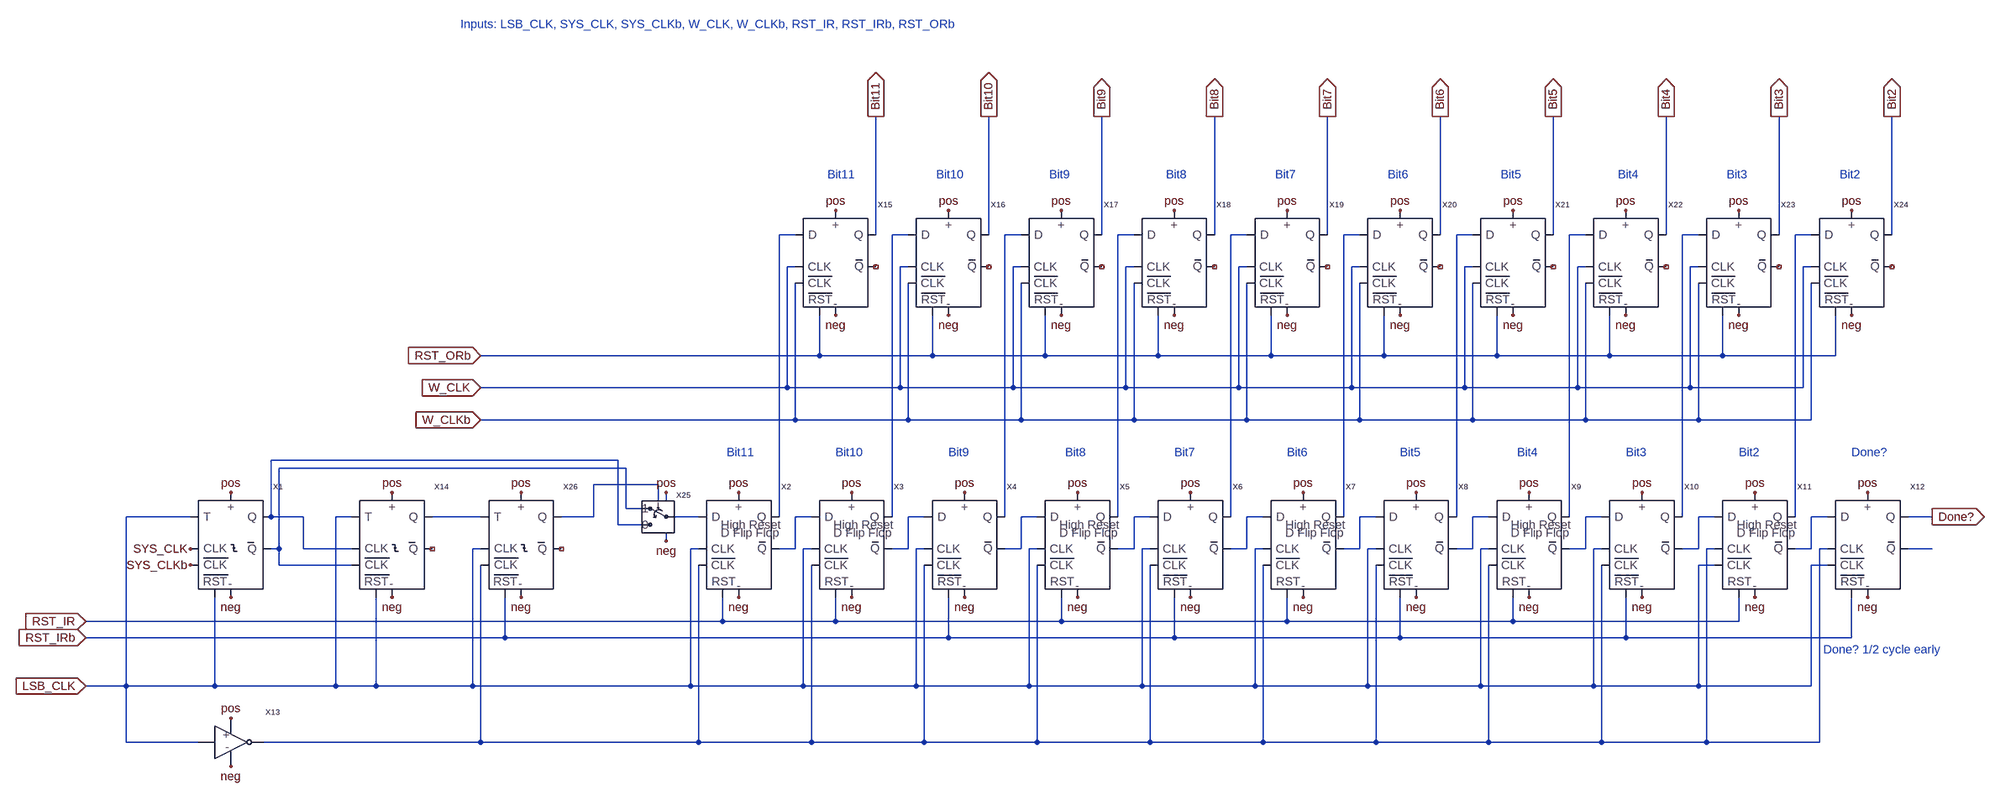
[diagram p0: schematic lsb_registers.asc]
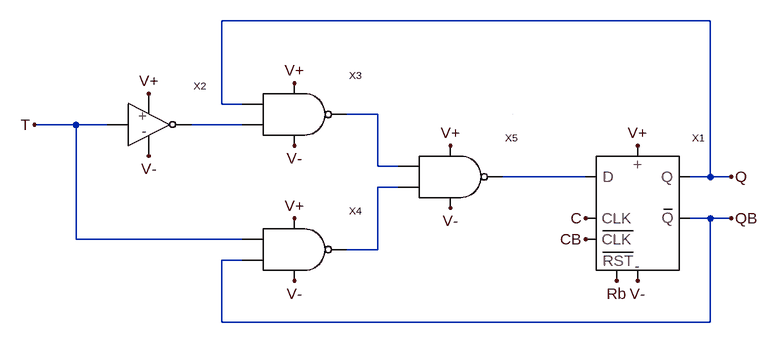
[diagram p1: sub-circuit t_flipflopreset_fe.asc]
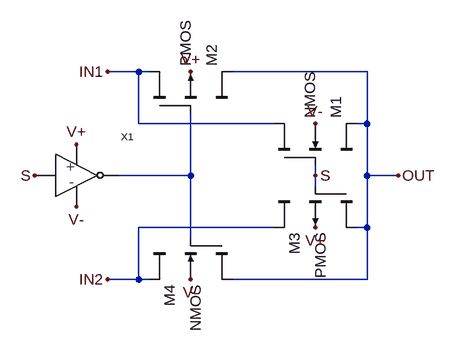
[diagram p2: sub-circuit spdt_1.asc]
lsb_registers.asc, the LTspice schematic file:
Version 4
SHEET 1 2676 1504
WIRE -1392 336 -1424 336
WIRE -1232 336 -1232 80
WIRE -1168 336 -1200 336
WIRE -1008 336 -1008 80
WIRE -944 336 -976 336
WIRE -784 336 -784 80
WIRE -720 336 -752 336
WIRE -560 336 -560 80
WIRE -496 336 -528 336
WIRE -336 336 -336 80
WIRE -272 336 -304 336
WIRE -112 336 -112 80
WIRE -48 336 -80 336
WIRE 112 336 112 80
WIRE 176 336 144 336
WIRE 336 336 336 80
WIRE 400 336 368 336
WIRE 560 336 560 80
WIRE 624 336 592 336
WIRE 784 336 784 80
WIRE -1392 400 -1408 400
WIRE -1168 400 -1184 400
WIRE -944 400 -960 400
WIRE -720 400 -736 400
WIRE -496 400 -512 400
WIRE -272 400 -288 400
WIRE -48 400 -64 400
WIRE 176 400 160 400
WIRE 400 400 384 400
WIRE 624 400 608 400
WIRE -1344 576 -1344 496
WIRE -1344 576 -2016 576
WIRE -1120 576 -1120 496
WIRE -1120 576 -1344 576
WIRE -896 576 -896 496
WIRE -896 576 -1120 576
WIRE -672 576 -672 496
WIRE -672 576 -896 576
WIRE -448 576 -448 496
WIRE -448 576 -672 576
WIRE -224 576 -224 496
WIRE -224 576 -448 576
WIRE 0 576 0 496
WIRE 0 576 -224 576
WIRE 224 576 224 496
WIRE 224 576 0 576
WIRE 448 576 448 496
WIRE 448 576 224 576
WIRE 672 576 672 496
WIRE 672 576 448 576
WIRE -1408 640 -1408 400
WIRE -1408 640 -2016 640
WIRE -1184 640 -1184 400
WIRE -1184 640 -1408 640
WIRE -960 640 -960 400
WIRE -960 640 -1184 640
WIRE -736 640 -736 400
WIRE -736 640 -960 640
WIRE -512 640 -512 400
WIRE -512 640 -736 640
WIRE -288 640 -288 400
WIRE -288 640 -512 640
WIRE -64 640 -64 400
WIRE -64 640 -288 640
WIRE 160 640 160 400
WIRE 160 640 -64 640
WIRE 384 640 384 400
WIRE 384 640 160 640
WIRE 608 640 608 400
WIRE 608 640 384 640
WIRE -1392 704 -1392 432
WIRE -1392 704 -2016 704
WIRE -1168 704 -1168 432
WIRE -1168 704 -1392 704
WIRE -944 704 -944 432
WIRE -944 704 -1168 704
WIRE -720 704 -720 432
WIRE -720 704 -944 704
WIRE -496 704 -496 432
WIRE -496 704 -720 704
WIRE -272 704 -272 432
WIRE -272 704 -496 704
WIRE -48 704 -48 432
WIRE -48 704 -272 704
WIRE 176 704 176 432
WIRE 176 704 -48 704
WIRE 400 704 400 432
WIRE 400 704 176 704
WIRE 624 704 624 432
WIRE 624 704 400 704
WIRE -1744 784 -2432 784
WIRE -1728 800 -2416 800
WIRE -1664 832 -1792 832
WIRE -1664 864 -1664 832
WIRE -1648 864 -1648 848
WIRE -1728 880 -1728 800
WIRE -1696 880 -1728 880
WIRE -2592 896 -2720 896
WIRE -2432 896 -2432 784
WIRE -2368 896 -2432 896
WIRE -2272 896 -2304 896
WIRE -2016 896 -2112 896
WIRE -1792 896 -1792 832
WIRE -1792 896 -1856 896
WIRE -1584 896 -1632 896
WIRE -1424 896 -1424 336
WIRE -1360 896 -1392 896
WIRE -1200 896 -1200 336
WIRE -1136 896 -1168 896
WIRE -976 896 -976 336
WIRE -912 896 -944 896
WIRE -752 896 -752 336
WIRE -688 896 -720 896
WIRE -528 896 -528 336
WIRE -464 896 -496 896
WIRE -304 896 -304 336
WIRE -240 896 -272 896
WIRE -80 896 -80 336
WIRE -16 896 -48 896
WIRE 144 896 144 336
WIRE 208 896 176 896
WIRE 368 896 368 336
WIRE 432 896 400 896
WIRE 592 896 592 336
WIRE 656 896 624 896
WIRE 864 896 816 896
WIRE -1744 912 -1744 784
WIRE -1696 912 -1744 912
WIRE -1648 944 -1648 928
WIRE -2416 960 -2416 800
WIRE -2416 960 -2432 960
WIRE -2368 960 -2368 896
WIRE -2272 960 -2368 960
WIRE -2016 960 -2032 960
WIRE -1584 960 -1600 960
WIRE -1392 960 -1392 896
WIRE -1392 960 -1424 960
WIRE -1360 960 -1376 960
WIRE -1168 960 -1168 896
WIRE -1168 960 -1200 960
WIRE -1136 960 -1152 960
WIRE -944 960 -944 896
WIRE -944 960 -976 960
WIRE -912 960 -928 960
WIRE -720 960 -720 896
WIRE -720 960 -752 960
WIRE -688 960 -704 960
WIRE -496 960 -496 896
WIRE -496 960 -528 960
WIRE -464 960 -480 960
WIRE -272 960 -272 896
WIRE -272 960 -304 960
WIRE -240 960 -256 960
WIRE -48 960 -48 896
WIRE -48 960 -80 960
WIRE -16 960 -32 960
WIRE 176 960 176 896
WIRE 176 960 144 960
WIRE 208 960 192 960
WIRE 400 960 400 896
WIRE 400 960 368 960
WIRE 432 960 416 960
WIRE 624 960 624 896
WIRE 624 960 592 960
WIRE 656 960 640 960
WIRE 864 960 816 960
WIRE -2416 992 -2416 960
WIRE -2272 992 -2416 992
WIRE 432 992 400 992
WIRE 656 992 624 992
WIRE -1536 1104 -1536 1056
WIRE -1536 1104 -2800 1104
WIRE -1312 1104 -1312 1056
WIRE -1312 1104 -1536 1104
WIRE -864 1104 -864 1056
WIRE -864 1104 -1312 1104
WIRE -416 1104 -416 1056
WIRE -416 1104 -864 1104
WIRE 32 1104 32 1056
WIRE 32 1104 -416 1104
WIRE 480 1104 480 1056
WIRE 480 1104 32 1104
WIRE -1968 1136 -1968 1056
WIRE -1968 1136 -2800 1136
WIRE -1088 1136 -1088 1056
WIRE -1088 1136 -1968 1136
WIRE -640 1136 -640 1056
WIRE -640 1136 -1088 1136
WIRE -192 1136 -192 1056
WIRE -192 1136 -640 1136
WIRE 256 1136 256 1056
WIRE 256 1136 -192 1136
WIRE 704 1136 704 1056
WIRE 704 1136 256 1136
WIRE -2720 1232 -2720 896
WIRE -2720 1232 -2800 1232
WIRE -2544 1232 -2544 1056
WIRE -2544 1232 -2720 1232
WIRE -2304 1232 -2304 896
WIRE -2304 1232 -2544 1232
WIRE -2224 1232 -2224 1056
WIRE -2224 1232 -2304 1232
WIRE -2032 1232 -2032 960
WIRE -2032 1232 -2224 1232
WIRE -1600 1232 -1600 960
WIRE -1600 1232 -2032 1232
WIRE -1376 1232 -1376 960
WIRE -1376 1232 -1600 1232
WIRE -1152 1232 -1152 960
WIRE -1152 1232 -1376 1232
WIRE -928 1232 -928 960
WIRE -928 1232 -1152 1232
WIRE -704 1232 -704 960
WIRE -704 1232 -928 1232
WIRE -480 1232 -480 960
WIRE -480 1232 -704 1232
WIRE -256 1232 -256 960
WIRE -256 1232 -480 1232
WIRE -32 1232 -32 960
WIRE -32 1232 -256 1232
WIRE 192 1232 192 960
WIRE 192 1232 -32 1232
WIRE 400 1232 400 992
WIRE 400 1232 192 1232
WIRE 624 1232 624 992
WIRE 624 1232 400 1232
WIRE -2720 1344 -2720 1232
WIRE -2576 1344 -2720 1344
WIRE -2016 1344 -2016 992
WIRE -2016 1344 -2448 1344
WIRE -1584 1344 -1584 992
WIRE -1584 1344 -2016 1344
WIRE -1360 1344 -1360 992
WIRE -1360 1344 -1584 1344
WIRE -1136 1344 -1136 992
WIRE -1136 1344 -1360 1344
WIRE -912 1344 -912 992
WIRE -912 1344 -1136 1344
WIRE -688 1344 -688 992
WIRE -688 1344 -912 1344
WIRE -464 1344 -464 992
WIRE -464 1344 -688 1344
WIRE -240 1344 -240 992
WIRE -240 1344 -464 1344
WIRE -16 1344 -16 992
WIRE -16 1344 -240 1344
WIRE 208 1344 208 992
WIRE 208 1344 -16 1344
WIRE 416 1344 416 960
WIRE 416 1344 208 1344
WIRE 640 1344 640 960
WIRE 640 1344 416 1344
FLAG -2800 1232 LSB_CLK
IOPIN -2800 1232 In
FLAG -2512 1296 pos
FLAG -2592 960 SYS_CLK
FLAG -2592 992 SYS_CLKb
FLAG -2800 1136 RST_IRb
IOPIN -2800 1136 In
FLAG -2016 704 W_CLKb
IOPIN -2016 704 In
FLAG -2016 640 W_CLK
IOPIN -2016 640 In
FLAG -2800 1104 RST_IR
IOPIN -2800 1104 In
FLAG -2016 576 RST_ORb
IOPIN -2016 576 In
FLAG -1232 80 Bit11
IOPIN -1232 80 Out
FLAG -1008 80 Bit10
IOPIN -1008 80 Out
FLAG -784 80 Bit9
IOPIN -784 80 Out
FLAG -560 80 Bit8
IOPIN -560 80 Out
FLAG -336 80 Bit7
IOPIN -336 80 Out
FLAG -112 80 Bit6
IOPIN -112 80 Out
FLAG 112 80 Bit5
IOPIN 112 80 Out
FLAG 336 80 Bit4
IOPIN 336 80 Out
FLAG 560 80 Bit3
IOPIN 560 80 Out
FLAG 784 80 Bit2
IOPIN 784 80 Out
FLAG -1312 288 pos
FLAG -1088 288 pos
FLAG -864 288 pos
FLAG -640 288 pos
FLAG -416 288 pos
FLAG -192 288 pos
FLAG 32 288 pos
FLAG 256 288 pos
FLAG 480 288 pos
FLAG 704 288 pos
FLAG -2512 848 pos
FLAG -1504 848 pos
FLAG -1280 848 pos
FLAG -1056 848 pos
FLAG -832 848 pos
FLAG -608 848 pos
FLAG -384 848 pos
FLAG -160 848 pos
FLAG 64 848 pos
FLAG 288 848 pos
FLAG 512 848 pos
FLAG 736 848 pos
FLAG -1312 496 neg
FLAG -1088 496 neg
FLAG -864 496 neg
FLAG -640 496 neg
FLAG -416 496 neg
FLAG -192 496 neg
FLAG 32 496 neg
FLAG 256 496 neg
FLAG 480 496 neg
FLAG 704 496 neg
FLAG 736 1056 neg
FLAG 512 1056 neg
FLAG 288 1056 neg
FLAG 64 1056 neg
FLAG -160 1056 neg
FLAG -384 1056 neg
FLAG -608 1056 neg
FLAG -832 1056 neg
FLAG -1056 1056 neg
FLAG -1280 1056 neg
FLAG -1504 1056 neg
FLAG -2512 1056 neg
FLAG 864 896 Done?
IOPIN 864 896 Out
FLAG -2512 1392 neg
FLAG -1648 944 neg
FLAG -1648 848 pos
FLAG -2192 848 pos
FLAG -2192 1056 neg
FLAG -1936 848 pos
FLAG -1936 1056 neg
SYMBOL T_FlipFlopReset_FE -2544 992 R0
SYMATTR InstName X1
SYMBOL FlipFlop -1056 960 R0
SYMATTR InstName X4
SYMATTR SpiceLine nmosL=0.9u nmosW=3u pmosL=0.9u pmosW=6u
SYMBOL FlipFlop -608 960 R0
SYMATTR InstName X6
SYMATTR SpiceLine nmosL=0.9u nmosW=3u pmosL=0.9u pmosW=6u
SYMBOL FlipFlop -160 960 R0
SYMATTR InstName X8
SYMATTR SpiceLine nmosL=0.9u nmosW=3u pmosL=0.9u pmosW=6u
SYMBOL FlipFlop 288 960 R0
SYMATTR InstName X10
SYMATTR SpiceLine nmosL=0.9u nmosW=3u pmosL=0.9u pmosW=6u
SYMBOL FlipFlop 736 960 R0
SYMATTR InstName X12
SYMATTR SpiceLine nmosL=0.9u nmosW=3u pmosL=0.9u pmosW=6u
SYMBOL Inverter -2512 1344 R0
SYMATTR InstName X13
SYMATTR SpiceLine nmosL=0.9u nmosW=12u pmosL=0.9u pmosW=24u
SYMBOL FlipFlop -1312 400 R0
SYMATTR InstName X15
SYMATTR SpiceLine nmosL=0.9u nmosW=3u pmosL=0.9u pmosW=6u
SYMBOL FlipFlop -1088 400 R0
SYMATTR InstName X16
SYMATTR SpiceLine nmosL=0.9u nmosW=3u pmosL=0.9u pmosW=6u
SYMBOL FlipFlop -864 400 R0
SYMATTR InstName X17
SYMATTR SpiceLine nmosL=0.9u nmosW=3u pmosL=0.9u pmosW=6u
SYMBOL FlipFlop -640 400 R0
SYMATTR InstName X18
SYMATTR SpiceLine nmosL=0.9u nmosW=3u pmosL=0.9u pmosW=6u
SYMBOL FlipFlop -416 400 R0
SYMATTR InstName X19
SYMATTR SpiceLine nmosL=0.9u nmosW=3u pmosL=0.9u pmosW=6u
SYMBOL FlipFlop -192 400 R0
SYMATTR InstName X20
SYMATTR SpiceLine nmosL=0.9u nmosW=3u pmosL=0.9u pmosW=6u
SYMBOL FlipFlop 32 400 R0
SYMATTR InstName X21
SYMATTR SpiceLine nmosL=0.9u nmosW=3u pmosL=0.9u pmosW=6u
SYMBOL FlipFlop 256 400 R0
SYMATTR InstName X22
SYMATTR SpiceLine nmosL=0.9u nmosW=3u pmosL=0.9u pmosW=6u
SYMBOL FlipFlop 480 400 R0
SYMATTR InstName X23
SYMATTR SpiceLine nmosL=0.9u nmosW=3u pmosL=0.9u pmosW=6u
SYMBOL FlipFlop 704 400 R0
SYMATTR InstName X24
SYMATTR SpiceLine nmosL=0.9u nmosW=3u pmosL=0.9u pmosW=6u
SYMBOL highResetFlipFlop -1504 960 R0
SYMATTR InstName X2
SYMATTR SpiceLine nmosL=0.9u nmosW=3u pmosL=0.9u pmosW=6u
SYMBOL highResetFlipFlop -1280 960 R0
SYMATTR InstName X3
SYMATTR SpiceLine nmosL=0.9u nmosW=3u pmosL=0.9u pmosW=6u
SYMBOL highResetFlipFlop -832 960 R0
SYMATTR InstName X5
SYMATTR SpiceLine nmosL=0.9u nmosW=3u pmosL=0.9u pmosW=6u
SYMBOL highResetFlipFlop -384 960 R0
SYMATTR InstName X7
SYMATTR SpiceLine nmosL=0.9u nmosW=3u pmosL=0.9u pmosW=6u
SYMBOL highResetFlipFlop 64 960 R0
SYMATTR InstName X9
SYMATTR SpiceLine nmosL=0.9u nmosW=3u pmosL=0.9u pmosW=6u
SYMBOL highResetFlipFlop 512 960 R0
SYMATTR InstName X11
SYMATTR SpiceLine nmosL=0.9u nmosW=3u pmosL=0.9u pmosW=6u
SYMBOL T_FlipFlopReset_FE -2224 992 R0
SYMATTR InstName X14
SYMBOL SPDT_1 -1648 896 R0
SYMATTR InstName X25
SYMATTR SpiceLine nmosL=0.9u nmosW=3u pmosL=0.9u pmosW=6u
SYMBOL T_FlipFlopReset_FE -1968 992 R0
SYMATTR InstName X26
TEXT -1528 768 Left 2 ;Bit11
TEXT -1312 768 Left 2 ;Bit10
TEXT -1088 768 Left 2 ;Bit9
TEXT -856 768 Left 2 ;Bit8
TEXT -640 768 Left 2 ;Bit7
TEXT -416 768 Left 2 ;Bit6
TEXT -192 768 Left 2 ;Bit5
TEXT 40 768 Left 2 ;Bit4
TEXT 256 768 Left 2 ;Bit3
TEXT 480 768 Left 2 ;Bit2
TEXT 704 768 Left 2 ;Done?
TEXT 648 1160 Left 2 ;Done? 1/2 cycle early
TEXT -2056 -104 Left 2 ;Inputs: LSB_CLK, SYS_CLK, SYS_CLKb, W_CLK, W_CLKb, RST_IR, RST_IRb, RST_ORb
TEXT -1328 216 Left 2 ;Bit11
TEXT -1112 216 Left 2 ;Bit10
TEXT -888 216 Left 2 ;Bit9
TEXT -656 216 Left 2 ;Bit8
TEXT -440 216 Left 2 ;Bit7
TEXT -216 216 Left 2 ;Bit6
TEXT 8 216 Left 2 ;Bit5
TEXT 240 216 Left 2 ;Bit4
TEXT 456 216 Left 2 ;Bit3
TEXT 680 216 Left 2 ;Bit2

t_flipflopreset_fe.asc, the sub-circuit schematic file:
Version 4
SHEET 1 880 680
WIRE 304 -144 -448 -144
WIRE -448 -16 -448 -144
WIRE -416 -16 -448 -16
WIRE -208 0 -256 0
WIRE -672 16 -736 16
WIRE -624 16 -672 16
WIRE -416 16 -496 16
WIRE -208 80 -208 0
WIRE -176 80 -208 80
WIRE 112 96 -16 96
WIRE 304 96 304 -144
WIRE 304 96 272 96
WIRE 336 96 304 96
WIRE -176 112 -208 112
WIRE 304 160 272 160
WIRE 336 160 304 160
WIRE -672 192 -672 16
WIRE -416 192 -672 192
WIRE -208 208 -208 112
WIRE -208 208 -256 208
WIRE -416 224 -448 224
WIRE -448 320 -448 224
WIRE 304 320 304 160
WIRE 304 320 -448 320
WIRE 0 0 0 0
FLAG 112 160 C
FLAG 112 192 CB
FLAG 160 256 Rb
FLAG -336 -48 V+
FLAG -336 48 V-
FLAG -336 160 V+
FLAG -336 256 V-
FLAG 192 48 V+
FLAG 192 256 V-
FLAG -560 -32 V+
FLAG -560 64 V-
FLAG -736 16 T
FLAG 336 96 Q
FLAG 336 160 QB
FLAG -96 48 V+
FLAG -96 144 V-
SYMBOL Inverter -560 16 R0
SYMATTR InstName X2
SYMATTR SpiceLine nmosL=0.9u nmosW=3u pmosL=0.9u pmosW=6u
SYMBOL FlipFlop 192 160 R0
SYMATTR InstName X1
SYMATTR SpiceLine nmosL=0.9u nmosW=3u pmosL=0.9u pmosW=6u
SYMBOL NAND -336 0 R0
SYMATTR InstName X3
SYMATTR SpiceLine nmosL=0.9u nmosW=3u pmosL=0.9u pmosW=6u
SYMBOL NAND -336 208 R0
SYMATTR InstName X4
SYMATTR SpiceLine nmosL=0.9u nmosW=3u pmosL=0.9u pmosW=6u
SYMBOL NAND -96 96 R0
SYMATTR InstName X5
SYMATTR SpiceLine nmosL=0.9u nmosW=3u pmosL=0.9u pmosW=6u

spdt_1.asc, the sub-circuit schematic file:
Version 4
SHEET 1 880 680
WIRE -16 160 -64 160
WIRE 0 160 -16 160
WIRE 336 160 128 160
WIRE -16 240 -16 160
WIRE 192 240 -16 240
WIRE 336 240 336 160
WIRE 336 240 320 240
WIRE 64 320 64 224
WIRE 64 320 -48 320
WIRE 256 320 256 304
WIRE 336 320 336 240
WIRE 384 320 336 320
WIRE 256 336 256 320
WIRE 192 400 -16 400
WIRE 336 400 336 320
WIRE 336 400 320 400
WIRE 64 416 64 320
WIRE -16 480 -16 400
WIRE -16 480 -64 480
WIRE 0 480 -16 480
WIRE 336 480 336 400
WIRE 336 480 128 480
FLAG 256 240 V-
FLAG 64 160 V+
FLAG 256 400 V+
FLAG 64 480 V-
FLAG 256 320 S
FLAG -64 160 IN1
FLAG -64 480 IN2
FLAG 384 320 OUT
FLAG -112 368 V-
FLAG -112 272 V+
FLAG -176 320 S
SYMBOL cktsym\\nmos4 256 240 M270
SYMATTR InstName M1
SYMATTR Value2 l=nmosL w=nmosW
SYMBOL cktsym\\pmos4 64 160 M270
SYMATTR InstName M2
SYMATTR Value2 l=pmosL w=pmosW
SYMBOL cktsym\\pmos4 256 400 M90
SYMATTR InstName M3
SYMATTR Value2 l=pmosL w=pmosW
SYMBOL cktsym\\nmos4 64 480 M90
SYMATTR InstName M4
SYMATTR Value2 l=nmosL w=nmosW
SYMBOL Inverter -112 320 R0
SYMATTR InstName X1
SYMATTR SpiceLine nmosL=nmosL nmosW=nmosW pmosL=pmosL pmosW=pmosW

The netlist it stands for:
* lsb_registers.asc
XX1 LSB_CLK SYS_CLKb N011 N012 neg pos SYS_CLK LSB_CLK t_flipflopreset_fe
XX4 N017 LSB_CLK N026 N003 N018 RST_IRb pos neg FlipFlop nmosL=0.9u nmosW=3u pmosL=0.9u pmosW=6u  ; pins D CLK CLKb Q Qb RESETb pos neg
XX6 N019 LSB_CLK N026 N005 N020 RST_IRb pos neg FlipFlop nmosL=0.9u nmosW=3u pmosL=0.9u pmosW=6u  ; pins D CLK CLKb Q Qb RESETb pos neg
XX8 N021 LSB_CLK N026 N007 N022 RST_IRb pos neg FlipFlop nmosL=0.9u nmosW=3u pmosL=0.9u pmosW=6u  ; pins D CLK CLKb Q Qb RESETb pos neg
XX10 N023 LSB_CLK N026 N009 N024 RST_IRb pos neg FlipFlop nmosL=0.9u nmosW=3u pmosL=0.9u pmosW=6u  ; pins D CLK CLKb Q Qb RESETb pos neg
XX12 N025 N026 LSB_CLK Done? N027 RST_IRb pos neg FlipFlop nmosL=0.9u nmosW=3u pmosL=0.9u pmosW=6u  ; pins D CLK CLKb Q Qb RESETb pos neg
XX13 LSB_CLK N026 pos neg Inverter nmosL=0.9u nmosW=12u pmosL=0.9u pmosW=24u  ; pins IN OUT pos neg
XX15 N001 W_CLK W_CLKb Bit11 NC_01 RST_ORb pos neg FlipFlop nmosL=0.9u nmosW=3u pmosL=0.9u pmosW=6u  ; pins D CLK CLKb Q Qb RESETb pos neg
XX16 N002 W_CLK W_CLKb Bit10 NC_02 RST_ORb pos neg FlipFlop nmosL=0.9u nmosW=3u pmosL=0.9u pmosW=6u  ; pins D CLK CLKb Q Qb RESETb pos neg
XX17 N003 W_CLK W_CLKb Bit9 NC_03 RST_ORb pos neg FlipFlop nmosL=0.9u nmosW=3u pmosL=0.9u pmosW=6u  ; pins D CLK CLKb Q Qb RESETb pos neg
XX18 N004 W_CLK W_CLKb Bit8 NC_04 RST_ORb pos neg FlipFlop nmosL=0.9u nmosW=3u pmosL=0.9u pmosW=6u  ; pins D CLK CLKb Q Qb RESETb pos neg
XX19 N005 W_CLK W_CLKb Bit7 NC_05 RST_ORb pos neg FlipFlop nmosL=0.9u nmosW=3u pmosL=0.9u pmosW=6u  ; pins D CLK CLKb Q Qb RESETb pos neg
XX20 N006 W_CLK W_CLKb Bit6 NC_06 RST_ORb pos neg FlipFlop nmosL=0.9u nmosW=3u pmosL=0.9u pmosW=6u  ; pins D CLK CLKb Q Qb RESETb pos neg
XX21 N007 W_CLK W_CLKb Bit5 NC_07 RST_ORb pos neg FlipFlop nmosL=0.9u nmosW=3u pmosL=0.9u pmosW=6u  ; pins D CLK CLKb Q Qb RESETb pos neg
XX22 N008 W_CLK W_CLKb Bit4 NC_08 RST_ORb pos neg FlipFlop nmosL=0.9u nmosW=3u pmosL=0.9u pmosW=6u  ; pins D CLK CLKb Q Qb RESETb pos neg
XX23 N009 W_CLK W_CLKb Bit3 NC_09 RST_ORb pos neg FlipFlop nmosL=0.9u nmosW=3u pmosL=0.9u pmosW=6u  ; pins D CLK CLKb Q Qb RESETb pos neg
XX24 N010 W_CLK W_CLKb Bit2 NC_10 RST_ORb pos neg FlipFlop nmosL=0.9u nmosW=3u pmosL=0.9u pmosW=6u  ; pins D CLK CLKb Q Qb RESETb pos neg
XX2 N015 LSB_CLK N026 N001 N016 RST_IR pos neg highResetFlipFlop nmosL=0.9u nmosW=3u pmosL=0.9u pmosW=6u  ; pins D CLK CLKb Q Qb RESET pos neg
XX3 N016 LSB_CLK N026 N002 N017 RST_IR pos neg highResetFlipFlop nmosL=0.9u nmosW=3u pmosL=0.9u pmosW=6u  ; pins D CLK CLKb Q Qb RESET pos neg
XX5 N018 LSB_CLK N026 N004 N019 RST_IR pos neg highResetFlipFlop nmosL=0.9u nmosW=3u pmosL=0.9u pmosW=6u  ; pins D CLK CLKb Q Qb RESET pos neg
XX7 N020 LSB_CLK N026 N006 N021 RST_IR pos neg highResetFlipFlop nmosL=0.9u nmosW=3u pmosL=0.9u pmosW=6u  ; pins D CLK CLKb Q Qb RESET pos neg
XX9 N022 LSB_CLK N026 N008 N023 RST_IR pos neg highResetFlipFlop nmosL=0.9u nmosW=3u pmosL=0.9u pmosW=6u  ; pins D CLK CLKb Q Qb RESET pos neg
XX11 N024 N026 LSB_CLK N010 N025 RST_IR pos neg highResetFlipFlop nmosL=0.9u nmosW=3u pmosL=0.9u pmosW=6u  ; pins D CLK CLKb Q Qb RESET pos neg
XX14 LSB_CLK N012 N014 NC_11 neg pos N011 LSB_CLK t_flipflopreset_fe
XX25 N012 N011 N015 N013 pos neg spdt_1 params: nmosL=0.9u nmosW=3u pmosL=0.9u pmosW=6u
XX26 N014 N026 N013 NC_12 neg pos LSB_CLK RST_IRb t_flipflopreset_fe

* block symbol definitions
.subckt t_flipflopreset_fe T CB Q QB V- V+ C Rb
XX2 T N002 V+ V- Inverter nmosL=0.9u nmosW=3u pmosL=0.9u pmosW=6u  ; pins IN OUT pos neg
XX1 N003 C CB Q QB Rb V+ V- FlipFlop nmosL=0.9u nmosW=3u pmosL=0.9u pmosW=6u  ; pins D CLK CLKb Q Qb RESETb pos neg
XX3 Q N001 N002 V+ V- NAND nmosL=0.9u nmosW=3u pmosL=0.9u pmosW=6u  ; pins A OUT B Vdd GROUND
XX4 T N004 QB V+ V- NAND nmosL=0.9u nmosW=3u pmosL=0.9u pmosW=6u  ; pins A OUT B Vdd GROUND
XX5 N001 N003 N004 V+ V- NAND nmosL=0.9u nmosW=3u pmosL=0.9u pmosW=6u  ; pins A OUT B Vdd GROUND
.ends t_flipflopreset_fe

.subckt spdt_1 IN1 IN2 OUT S V+ V-
M1 OUT S IN1 V- NMOS l=nmosL w=nmosW
M2 IN1 N001 OUT V+ PMOS l=pmosL w=pmosW
M3 OUT S IN2 V+ PMOS l=pmosL w=pmosW
M4 IN2 N001 OUT V- NMOS l=nmosL w=nmosW
XX1 S N001 V+ V- Inverter nmosL=nmosL nmosW=nmosW pmosL=pmosL pmosW=pmosW  ; pins IN OUT pos neg
.ends spdt_1

.model NMOS NMOS
.model PMOS PMOS
.lib standard.mos
* Bit11
* Bit10
* Bit9
* Bit8
* Bit7
* Bit6
* Bit5
* Bit4
* Bit3
* Bit2
* Done?
* Done? 1/2 cycle early
* Inputs: LSB_CLK, SYS_CLK, SYS_CLKb, W_CLK, W_CLKb, RST_IR, RST_IRb, RST_ORb
* Bit11
* Bit10
* Bit9
* Bit8
* Bit7
* Bit6
* Bit5
* Bit4
* Bit3
* Bit2
.backanno
.end